# EAGLE design lightmeter (EAGLE 7.6.0)
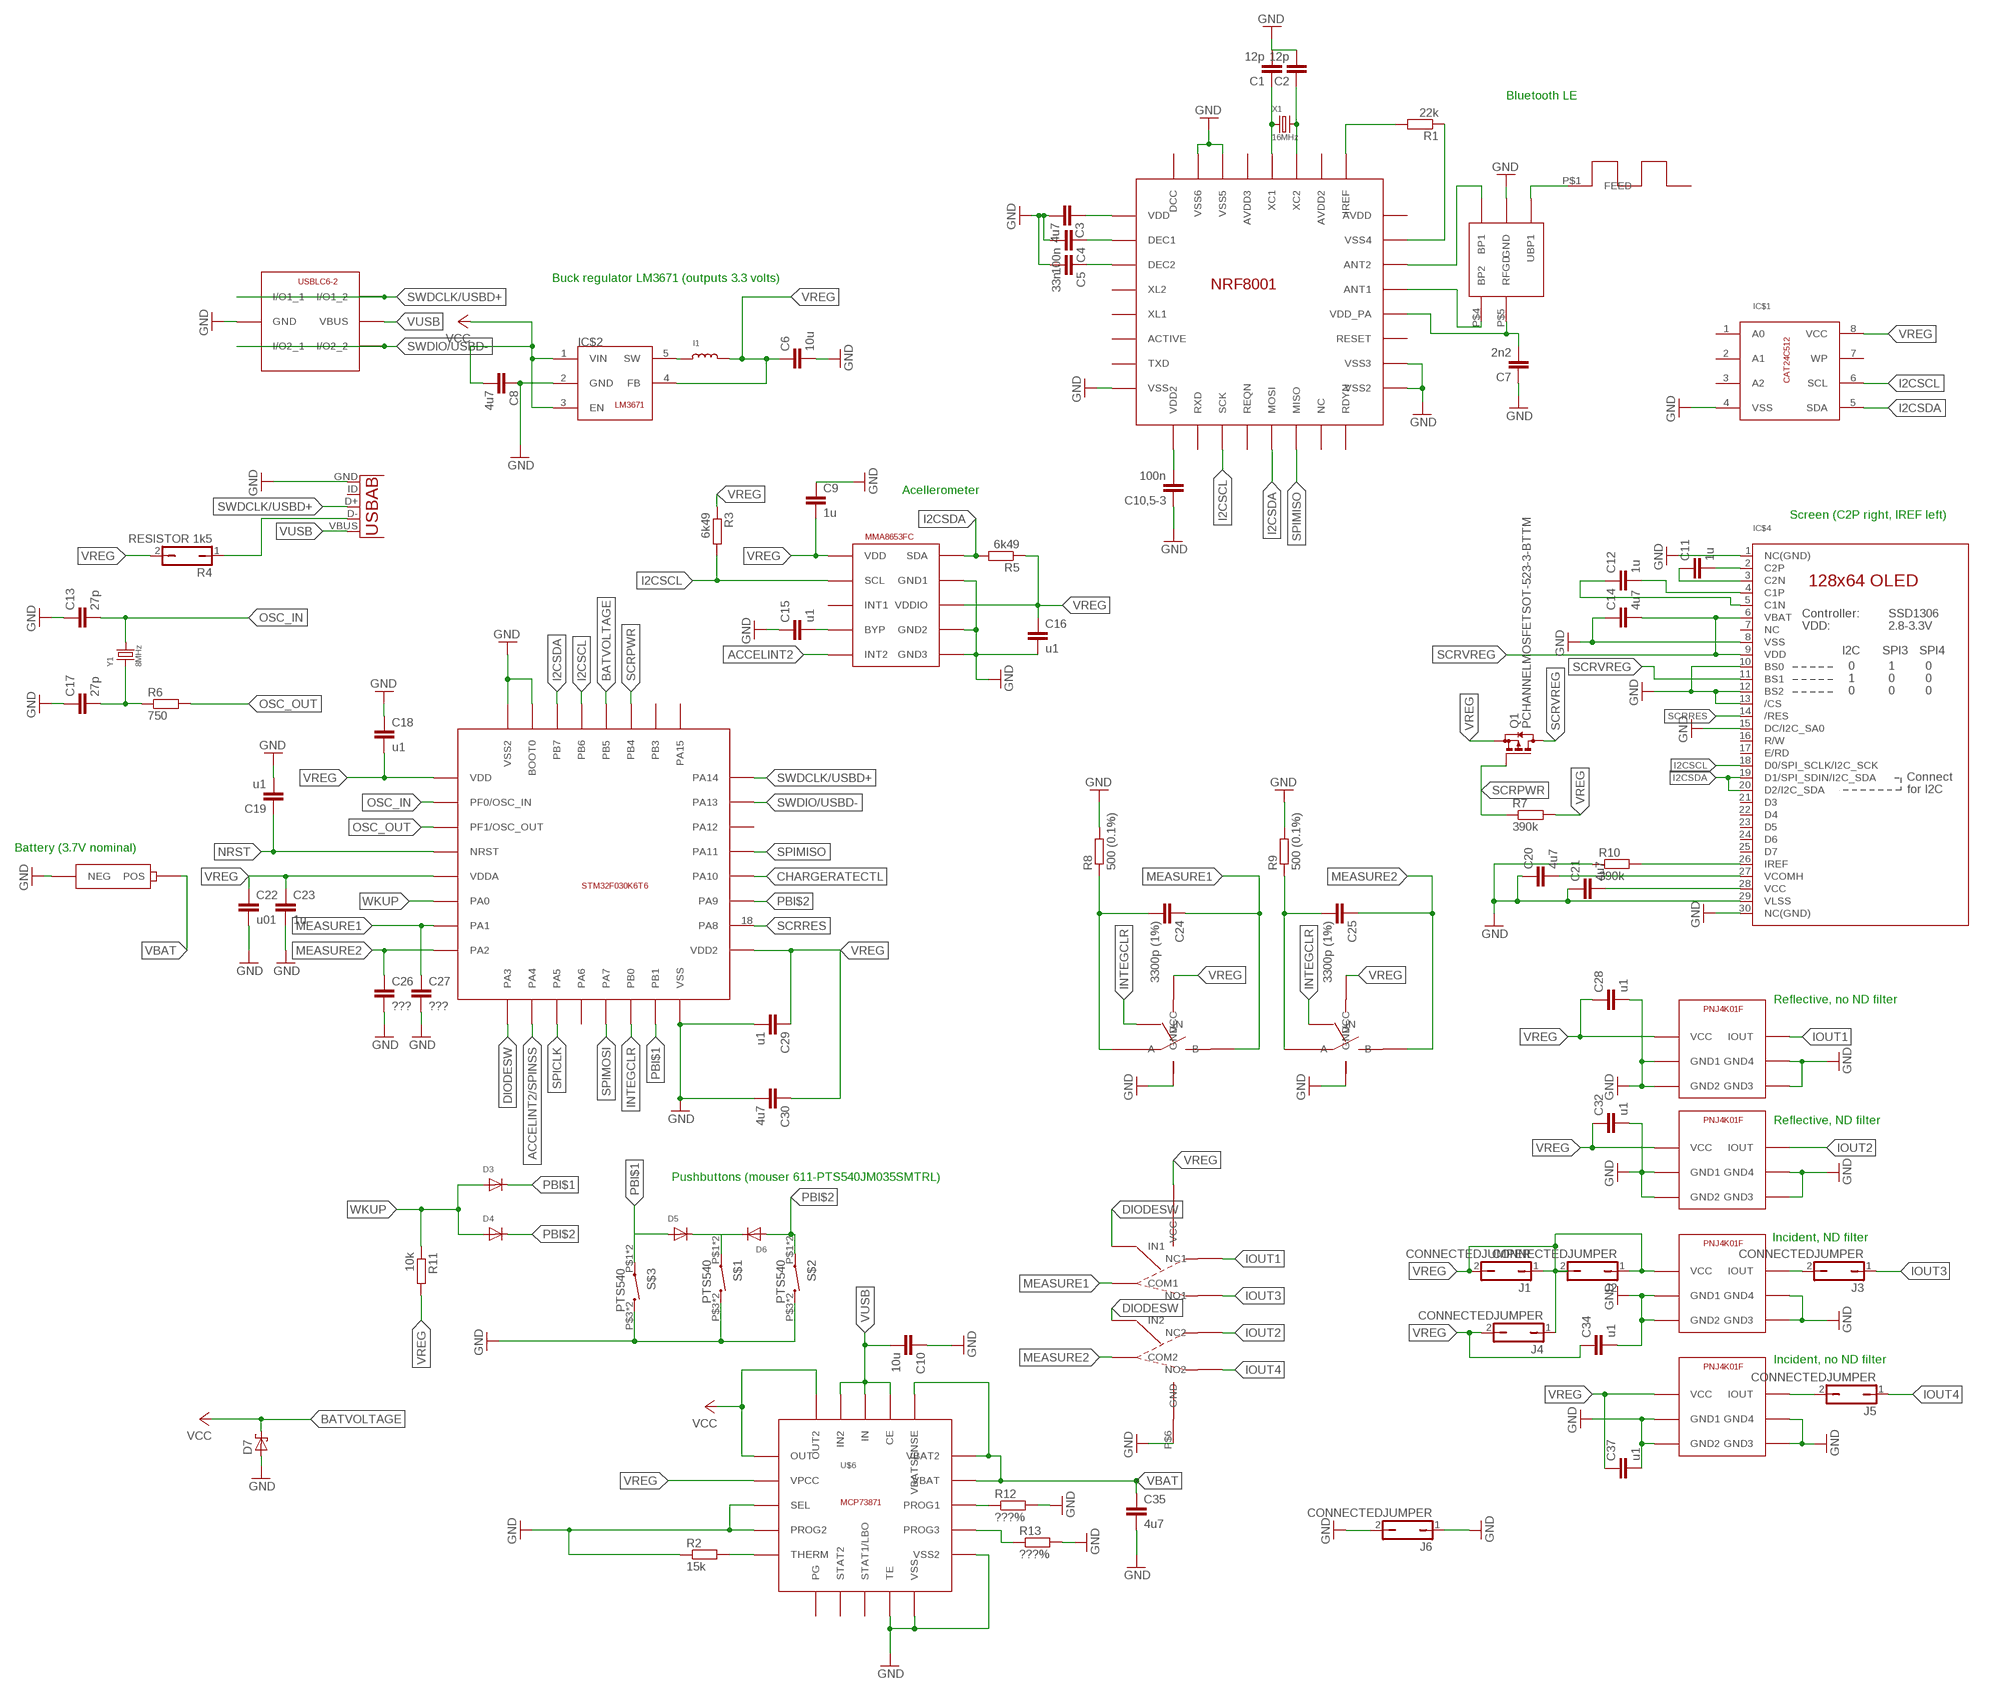
[diagram p0: schematic, sheet 1]

## Parts
C1  12p  C-EUC0402  [C0402]
C2  12p  C-EUC0402  [C0402]
C3  4u7  C-EUC0402  [C0402]
C4  100n  C-EUC0402  [C0402]
C5  33n  C-EUC0402  [C0402]
C6  10u  C-EUC0603  [C0603]
C7  2n2  C-EUC0402  [C0402]
C8  4u7  C-EUC0402  [C0402]
C9  1u  C-EUC0603  [C0603]
C10  10u  C-EUC0402  [C0402]
C10,5-3  100n  C-EUC0402  [C0402]
C11  1u  C-EUC0402  [C0402]
C12  1u  C-EUC0402  [C0402]
C13  27p  CGAP0402  [GAP0402]
C14  4u7  C-EUC0402  [C0402]
C15  u1  C-EUC0402  [C0402]
C16  u1  C-EUC0402  [C0402]
C17  27p  C-EUC0402  [C0402]
C18  u1  C-EUC0402  [C0402]
C19  u1  C-EUC0402  [C0402]
C20  4u7  C-EUC0402  [C0402]
C21  4u7  C-EUC0402  [C0402]
C22  u01  CGAP0402  [GAP0402]
C23  1u  C  [GAP0603]
C24  3300p (1%)  C-EUC0603  [C0603]
C25  3300p (1%)  C-EUC0603  [C0603]
C26  ???  CGAP0402  [GAP0402]
C27  ???  CGAP0402  [GAP0402]
C28  u1  C-EUC0402  [C0402]
C29  u1  C-EUC0402  [C0402]
C30  4u7  C-EUC0402  [C0402]
C32  u1  C-EUC0402  [C0402]
C34  u1  C-EUC0402  [C0402]
C35  4u7  C-EUC0402  [C0402]
C37  u1  C-EUC0402  [C0402]
D3  DIODESOD-323F  [SOD-323F]
D4  DIODESOD-323F  [SOD-323F]
D5  DIODESOD-323F  [SOD-323F]
D6  DIODESOD-323F  [SOD-323F]
D7  SCHOTTKY-DIODESOD-929  [SOD-923]
I1  CDRH2D14  [CDRH2D14]
IC$1  CAT24C512  [TSSOP8]
IC$2  LM3671  [SOT23-5]
IC$3  MMA8653  [DFN-10]
IC$4  DISP_OLED_UG-2864HSWEG010.96"  [UG-2864HSWEG01_0.96IN_WRAPAROUND]
IC$5  STM32F030K6T6  [QFP-32]
IC$6  SN74LVC1G66  [SOT-553-5]
IC$7  SN74LVC1G66  [SOT-553-5]
IC$8  PNJ4K01F  [PNJ4K01F]
IC$9  PNJ4K01F  [PNJ4K01F]
IC$11  PNJ4K01F  [PNJ4K01F]
IC$12  NLAS5223B  [WQFN10]
IC$13  PNJ4K01F  [PNJ4K01F]
J1  CONNECTEDJUMPER  [JUMPER_R0402]
J2  CONNECTEDJUMPER  [JUMPER_R0402]
J3  CONNECTEDJUMPER  [JUMPER_R0402]
J4  CONNECTEDJUMPER  [JUMPER_R0402]
J5  CONNECTEDJUMPER  [JUMPER_R0402]
J6  CONNECTEDJUMPER  [JUMPER_R0402]
Q1  PCHANNELMOSFETSOT-523-3-BTTM  [SOT-523-3-BTTM]
R1  22k  R-EU_R0402  [R0402]
R2  15k  R-EU_R0402  [R0402]
R3  6k49  R-EU_R0402  [R0402]
R4  RESISTOR 1k5  CONNECTEDJUMPER  [JUMPER_R0402]
R5  6k49  R-EU_R0402  [R0402]
R6  750  R-EU_R0402  [R0402]
R7  390k  R-EU_R0402  [R0402]
R8  500 (0.1%)  R-EU_R0402  [R0402]
R9  500 (0.1%)  R-EU_R0402  [R0402]
R10  390k  R-EU_R0402  [R0402]
R11  10k  R-EU_R0402  [R0402]
R12  ???%  R-EU_R0402  [R0402]
R13  ???%  R-EU_R0402  [R0402]
S$1  PTS540  [PTS540BTM]
S$2  PTS540  [PTS540BTM]
S$3  PTS540  [PTS540BTM]
U1  USB-ABUSB-AB-MICRO-MIDMOUNT  [USB-AB-MICRO-MIDMOUNT]
U$1  2450AT18A100  [2450AT18A100]
U$2  2450BM14A00022450BM14A0002  [2450BM14A0002]
U$3  NRF8001  [NRF8001]
U$4  USBLC6-2  [SOT666]
U$5  LIBAT  [78171-0002]
U$6  MCP73871  [QFN20]
X1  16MHz  CRYSTALCRYSTAL-2X1.6  [CRYSTAL-2X1.6]
Y1  8MHz  CRYSTAL  [CRYSTAL3.2X5MM]

## Nets
ACCELINT2: IC$3.P$5(INT2)
ACCELINT2/SPINSS: IC$5.10(PA4)
ANT1CON: U$2.P$4(BP2) U$3.P$21(ANT1)
ANT2CON: U$2.P$3(BP1) U$3.P$22(ANT2)
ANTTRACE: U$1.P$1(FEED) U$2.P$1(UBP1)
BATVOLTAGE: D7.P$2(C) IC$5.28(PB5) ; supply symbol labelled VCC
CHARGERATECTL: IC$5.20(PA10)
DIODESW: IC$5.9(PA3) IC$12.P$4(IN1) IC$12.P$8(IN2)
GND: C1.2 C2.2 C3.2 C4.2 C5.2 C6.2 C7.1 C8.1 C9.1 C10,5-3.1 C10.1 C13.1 C14.1 C15.1 C16.2 C17.1 C18.1 C19.2 C20.1 C21.1 C22.2 C23.2 C26.2 C27.2 C28.2 C29.2 C30.2 C32.2 C34.2 C35.2 C37.2 D7.P$1(A) IC$1.4(VSS) IC$2.2(GND) IC$3.P$6(GND3) IC$3.P$7(GND2) IC$3.P$9(GND1) IC$4.1(NC(GND)) IC$4.8(VSS) IC$4.10(BS0) IC$4.12(BS2) IC$4.13(/CS) IC$4.15(DC/I2C_SA0) IC$4.29(VLSS) IC$4.30(NC(GND)) IC$5.16(VSS) IC$5.31(BOOT0) IC$5.32(VSS2) IC$6.P$3(GND) IC$7.P$3(GND) IC$8.P$2(GND1) IC$8.P$3(GND2) IC$8.P$4(GND3) IC$8.P$5(GND4) IC$9.P$2(GND1) IC$9.P$3(GND2) IC$9.P$4(GND3) IC$9.P$5(GND4) IC$11.P$2(GND1) IC$11.P$3(GND2) IC$11.P$4(GND3) IC$11.P$5(GND4) IC$12.P$6(GND) IC$13.P$2(GND1) IC$13.P$3(GND2) IC$13.P$4(GND3) IC$13.P$5(GND4) J6.1 J6.2 R2.1 R8.2 R9.2 R10.1 R12.2 R13.2 S$1.P$3 S$1.P$4 S$2.P$3 S$2.P$4 S$3.P$3 S$3.P$4 U1.GND U$2.P$2(GND) U$3.P$8(VSS) U$3.P$17(VSS2) U$3.P$18(VSS3) U$3.P$30(VSS5) U$3.P$31(VSS6) U$3.P$33(VSS) U$4.P$2(GND) U$5.P$1(NEG) U$6.P$3(SEL) U$6.P$4(PROG2) U$6.P$9(TE) U$6.P$10(VSS) U$6.P$11(VSS2) U$6.P$21(VSS2)
I2CSCL: IC$1.6(SCL) IC$3.P$2(SCL) IC$4.18(D0/SPI_SCLK/I2C_SCK) IC$5.29(PB6) R3.2 U$3.P$11(SCK)
I2CSDA: IC$1.5(SDA) IC$3.P$10(SDA) IC$4.19(D1/SPI_SDIN/I2C_SDA) IC$4.20(D2/I2C_SDA) IC$5.30(PB7) R5.2 U$3.P$13(MOSI)
INTEGCLR: IC$5.14(PB0) IC$6.P$4(IN) IC$7.P$4(IN)
IOUT1: IC$8.P$6(IOUT) IC$12.P$5(NC1)
IOUT2: IC$9.P$6(IOUT) IC$12.P$7(NC2)
IOUT3: IC$12.P$2(NO1) J3.1
IOUT4: IC$12.P$10(NO2) J5.1
MEASURE1: C24.1 C27.1 IC$5.7(PA1) IC$6.P$2(B) IC$12.P$3(COM1)
MEASURE2: C25.1 C26.1 IC$5.8(PA2) IC$7.P$2(B) IC$12.P$9(COM2)
N$1: IC$11.P$6(IOUT) J3.2
N$2: IC$13.P$6(IOUT) J5.2
N$3: C24.2 IC$6.P$1(A) R8.1
N$4: R2.2 U$6.P$5(THERM)
N$6: C25.2 IC$7.P$1(A) R9.1
N$7: C15.2 IC$3.P$4(BYP)
N$9: C17.2 R6.1 Y1.P$1
N$10: I1.P$1 IC$2.5(SW)
N$12: C20.2 IC$4.27(VCOMH)
N$13: D5.C D6.C S$1.P$1 S$1.P$2
N$15: C11.2 IC$4.2(C2P)
N$16: C11.1 IC$4.3(C2N)
N$17: C7.2 U$2.P$5(RFGD) U$3.P$20(VDD_PA)
N$18: R1.2 U$3.P$25(IREF)
N$19: IC$4.26(IREF) R10.2
N$20: R1.1 U$3.P$23(VSS4)
N$21: C5.1 U$3.P$3(DEC2)
N$22: C3.1 U$3.P$1(VDD)
N$23: C10,5-3.2 U$3.P$9(VDD2)
N$24: C12.1 IC$4.5(C1N)
N$25: C4.1 U$3.P$2(DEC1)
N$26: C1.1 U$3.P$28(XC1) X1.P$1
N$27: C12.2 IC$4.4(C1P)
N$28: C2.1 U$3.P$27(XC2) X1.P$3
N$30: C21.2 IC$4.28(VCC)
N$32: R12.1 U$6.P$13(PROG1)
N$33: R13.1 U$6.P$12(PROG3)
NRST: C19.1 IC$5.4(NRST)
OSC_IN: C13.2 IC$5.2(PF0/OSC_IN) Y1.P$2
OSC_OUT: IC$5.3(PF1/OSC_OUT) R6.2
PBI$1: D3.C D5.A IC$5.15(PB1) S$3.P$1 S$3.P$2
PBI$2: D4.C D6.A IC$5.19(PA9) S$2.P$1 S$2.P$2
SCRPWR: IC$5.27(PB4) Q1.P$3(G) R7.1
SCRRES: IC$4.14(/RES) IC$5.18(PA8)
SCRVREG: C14.2 IC$4.6(VBAT) IC$4.9(VDD) IC$4.11(BS1) Q1.P$1(D)
SPICLK: IC$5.11(PA5)
SPIMISO: IC$5.21(PA11) U$3.P$14(MISO)
SPIMOSI: IC$5.13(PA7)
SWDCLK/USBD+: IC$5.24(PA14) U1.D+ U$4.P$1(I/O1_1) U$4.P$6(I/O1_2)
SWDIO/USBD-: IC$5.23(PA13) U$4.P$3(I/O2_1) U$4.P$4(I/O2_2)
USBD-: R4.1 U1.D-
VBAT: C35.1 U$5.P$2(POS) U$6.P$14(VBAT) U$6.P$15(VBAT2) U$6.P$16(VBATSENSE)
VCC: C8.2 IC$2.1(VIN) IC$2.3(EN) U$6.P$1(OUT) U$6.P$20(OUT2)
VREG: C6.1 C9.2 C16.1 C18.2 C22.1 C23.1 C28.1 C29.1 C30.1 C32.1 C34.1 C37.1 I1.P$2 IC$1.8(VCC) IC$2.4(FB) IC$3.P$1(VDD) IC$3.P$8(VDDIO) IC$5.1(VDD) IC$5.5(VDDA) IC$5.17(VDD2) IC$6.P$5(VCC) IC$7.P$5(VCC) IC$8.P$1(VCC) IC$9.P$1(VCC) IC$11.P$1(VCC) IC$12.P$1(VCC) IC$13.P$1(VCC) J1.1 J1.2 J2.1 J2.2 J4.1 J4.2 Q1.P$2(S) R3.1 R4.2 R5.1 R7.2 R11.2 U$6.P$2(VPCC)
VUSB: C10.2 U1.VBUS U$4.P$5(VBUS) U$6.P$17(CE) U$6.P$18(IN) U$6.P$19(IN2)
WKUP: D3.A D4.A IC$5.6(PA0) R11.1
Unconnected: IC$1.1(A0) IC$1.2(A1) IC$1.3(A2) IC$1.7(WP) IC$3.P$3(INT1) IC$4.7(NC) IC$4.16(R/W) IC$4.17(E/RD) IC$4.21(D3) IC$4.22(D4) IC$4.23(D5) IC$4.24(D6) IC$4.25(D7) IC$5.12(PA6) IC$5.22(PA12) IC$5.25(PA15) IC$5.26(PB3) U1.ID(USBID) U$3.P$4(XL2) U$3.P$5(XL1) U$3.P$6(ACTIVE) U$3.P$7(TXD) U$3.P$10(RXD) U$3.P$12(REQN) U$3.P$15(NC) U$3.P$16(RDYN) U$3.P$19(RESET) U$3.P$24(AVDD) U$3.P$26(AVDD2) U$3.P$29(AVDD3) U$3.P$32(DCC) U$6.P$6(PG) U$6.P$7(STAT2) U$6.P$8(STAT1/LBO)

## Notes on the sheet
- Bluetooth LE
- Buck regulator LM3671 (outputs 3.3 volts)
- Acellerometer
- Screen (C2P right, IREF left)
- Battery (3.7V nominal)
- Reflective, no ND filter
- Reflective, ND filter
- Pushbuttons (mouser 611-PTS540JM035SMTRL)
- Incident, ND filter
- Incident, no ND filter

## Library data of the parts
C1-C10 C10,5-3 C11 C12 C14-C21 C24 C25 C28-C30 C32 C34 C35 C37 = rcl:C-EU: CAPACITOR, European symbol
C13 C22 C23 C26 C27 = lightmeter:C: CAPACITOR naming: grid - package width
D3-D6 = adafruit:DIODE: Diode SMADIODE - SMA Surface Mount Package 20V 1A Schottky Diode Digikey: 641-1014-6-ND DO-1N4148 - Through Hole Small Current Diode SOD-123 20V 1 A (.5mV Vf) Schottky Diode - Digikey: MBRX120TPMSCT-ND SOD-323 10V 570mA (.38mV Vf, 3ns) Schottky Diode - Digikey: ZLLS410CT-ND SOD-523 30V 30mA Schottky Diode (RB751S-40TE61) - Digikey: RB751S-40TE61CT-ND SOT23-R/W - SOT23 Package (R = Solder Paste/Reflow Ovens, W = Hand-Soldering) BAT54Film 40V 300mA - Digikey: 497-7162-1-ND
D7 = lightmeter:SCHOTTKY-DIODE: Schottky Diode
I1 = lightmeter:CDRH2D14
IC$1 = lightmeter:CAT24C512
IC$2 = lightmeter:LM3671
IC$3 = lightmeter:MMA8653
IC$4 = microbuilder:DISP_OLED_UG-2864HSWEG01: UG-2864HSWEG01 OLED display Both 1.3" and 0.96" models share the same FPC tab footprint, only the screen dimensions vary.
IC$5 = lightmeter:STM32F030K6T6
IC$6 IC$7 = lightmeter:SN74LVC1G66
IC$8 IC$9 IC$11 IC$13 = lightmeter:PNJ4K01F
IC$12 = lightmeter:NLAS5223B
J1-J6 R4 = lightmeter:CONNECTEDJUMPER
Q1 = lightmeter:PCHANNELMOSFET
R1-R3 R5-R13 = resistor:R-EU_: RESISTOR, European symbol
S$1-S$3 = lightmeter:PTS540
U1 = lightmeter:USB-AB: This is a USB AB connector that is compatible with USB OTG. i.e. this connector can serve as a host or device
U$1 = lightmeter:2450AT18A100
U$2 = lightmeter:2450BM14A0002
U$3 = lightmeter:NRF8001
U$4 = lightmeter:USBLC6-2
U$5 = lightmeter:LIBAT
U$6 = lightmeter:MCP73871
X1 Y1 = lightmeter:CRYSTAL

## Board
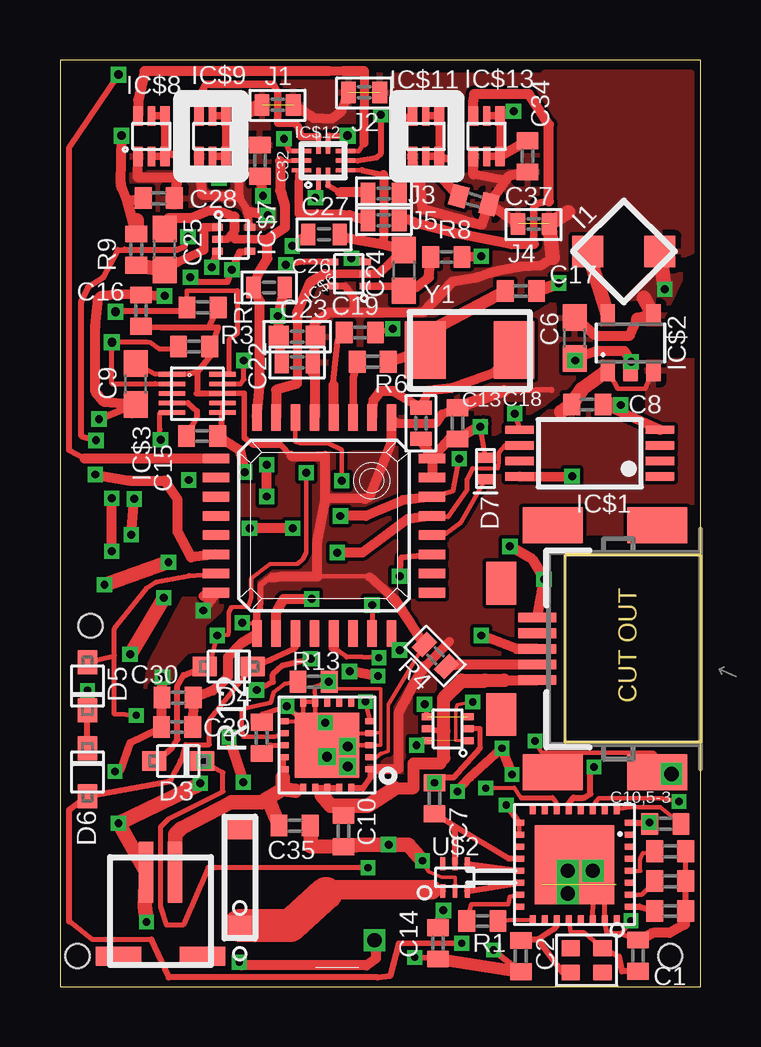
[diagram p1: board, top side]
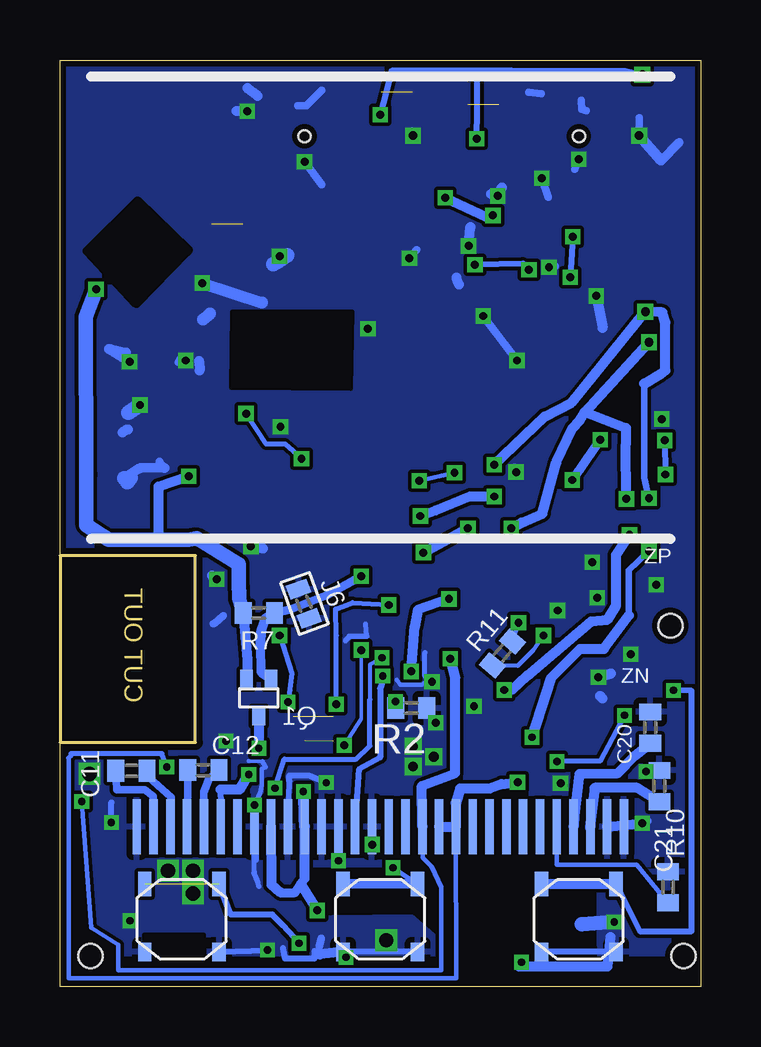
[diagram p2: board, bottom side, seen from below]

Size 26.7 x 38.61 mm. Coordinates in mm from the lower left corner, seen from the top.
Outline: 0,0 26.7,0 26.7,38.61 0,38.61 0,0
Copper layers (1*16): Top 0.035mm / dielectric 1.5mm / Bottom 0.035mm
Design rules "SeeedStudio_2layer_DRU_no_angle_20140221": minimum track width 6mil, minimum drill 12mil, track to track 6mil, track to pad 6mil, pad to pad 6mil, via to via 6mil, smd to smd 0mil, copper to edge 10mil, drill to drill 10mil, minimum pad ring 10mil, minimum via ring 6mil, stop-mask expansion 2mil, vias tented up to drill 100mil, thermal gap 10mil
Holes 1 mm at 25.43,1.27 0.72,1.27 1.27,15.04
Holes 0.5 mm at 5.08,35.43 16.51,35.43
tRestrict: area 3,34.9 to 4.6,36; area 5.6,34.9 to 7.1,36; area 14.5,34.9 to 16,36; area 17,34.9 to 18.6,36; area 21.4,28.7 to 25.2,32.6; area 22.4,26 to 25.2,27.6; area 9.6,32.6 to 12.3,35.6; area 7.5,15.2 to 14.2,15.9; area 14.6,22.7 to 16.8,24.1; area 7.6,22.5 to 13.7,23.1; area 20.6,27.9 to 22.2,29.4; area 23.2,27.8 to 24.2,28.5
bRestrict: area 6.7,1.5 to 16.1,4.9; area 4.4,0.5 to 9.1,5.5; area 20.7,0.1 to 23.2,2.2; area 21.4,28.5 to 25.6,32.7; area 14.5,24.9 to 19.6,28.1; 3 lines

### Footprints (pad centres in the part's own frame; a part is rotated, then mirrored left to right if it is on the bottom)
C0402 = smd 0.7 x 0.9: 1 -0.65,0; 2 0.65,0
C0603 = smd 1.1 x 1: 1 -0.85,0; 2 0.85,0
GAP0402 = smd 0.584 x 0.9: 1 -0.65,0; 2 0.65,0
GAP0603 = smd 0.819 x 0.9: 1 -0.767,0; 2 0.767,0
SOD-323F = smd 1 x 0.8: A -1,0; C 1,0
SOD-923 = smd 0.425 x 0.6: P$1 -0.45,0; P$2 0.45,0
CDRH2D14 = smd 1.3 x 1.3 rotated 45: P$1 -1.061,1.061; P$2 1.061,-1.061
TSSOP8 = smd 1.2 x 0.35: 1 -2.925,0.975; 2 -2.925,0.325; 3 -2.925,-0.325; 4 -2.925,-0.975; 5 2.925,-0.975; 6 2.925,-0.325; 7 2.925,0.325; 8 2.925,0.975
SOT23-5 = smd 0.6 x 0.9: 1 -0.95,-1.15; 2 0,-1.15; 3 0.95,-1.15; 4 0.95,1.15; 5 -0.95,1.15
DFN-10 = smd 0.191 x 1.099: P$1 -0.8,-1.048; P$2 -0.4,-1.048; P$3 0,-1.048; P$4 0.4,-1.048; P$5 0.8,-1.048; P$6 0.8,1.048; P$7 0.4,1.048; P$8 0,1.048; P$9 -0.4,1.048; P$10 -0.8,1.048
UG-2864HSWEG01_0.96IN_WRAPAROUND = smd 0.35 x 2.286 bottom: 1 -10.15,-1.2; 2 -9.45,-1.2; 3 -8.75,-1.2; 4 -8.05,-1.2; 5 -7.35,-1.2; 6 -6.65,-1.2; 7 -5.95,-1.2; 8 -5.25,-1.2; 9 -4.55,-1.2; 10 -3.85,-1.2; 11 -3.15,-1.2; 12 -2.45,-1.2; 13 -1.75,-1.2; 14 -1.05,-1.2; 15 -0.35,-1.2; 16 0.35,-1.2; 17 1.05,-1.2; 18 1.75,-1.2; 19 2.45,-1.2; 20 3.15,-1.2; 21 3.85,-1.2; 22 4.55,-1.2; 23 5.25,-1.2; 24 5.95,-1.2; 25 6.65,-1.2; 26 7.35,-1.2; 27 8.05,-1.2; 28 8.75,-1.2; 29 9.45,-1.2; 30 10.15,-1.2
QFP-32 = smd 0.4 x 1.1: 1 -2.4,-4.1; 2 -1.6,-4.1; 3 -0.8,-4.1; 4 0,-4.1; 5 0.8,-4.1; 6 1.6,-4.1; 7 2.4,-4.1; 8 3.2,-4.1; 17 3.2,4.9; 18 2.4,4.9; 19 1.6,4.9; 20 0.8,4.9; 21 0,4.9; 22 -0.8,4.9; 23 -1.6,4.9; 24 -2.4,4.9 | smd 1.1 x 0.4: 9 4.9,-2.4; 10 4.9,-1.6; 11 4.9,-0.8; 12 4.9,0; 13 4.9,0.8; 14 4.9,1.6; 15 4.9,2.4; 16 4.9,3.2; 25 -4.1,3.2; 26 -4.1,2.4; 27 -4.1,1.6; 28 -4.1,0.8; 29 -4.1,0; 30 -4.1,-0.8; 31 -4.1,-1.6; 32 -4.1,-2.4
SOT-553-5 = smd 0.45 x 0.279: P$1 -0.675,0.5; P$2 -0.675,0; P$3 -0.675,-0.5; P$4 0.675,-0.5; P$5 0.675,0.5
PNJ4K01F = smd 0.813 x 0.401: P$1 -0.843,0.56; P$3 -0.843,-0.56; P$4 0.843,-0.56; P$6 0.843,0.56 | smd 0.813 x 0.3: P$2 -0.843,0; P$5 0.843,0
WQFN10 = smd 0.917 x 0.178: P$1 -0.747,0.199 | smd 0.815 x 0.178: P$2 -0.696,-0.199; P$6 0.696,-0.199; P$7 0.696,0.199 | smd 0.178 x 0.815: P$3 -0.399,-0.914; P$4 0,-0.914; P$5 0.399,-0.914 | smd 0.178 x 0.805: P$8 0.399,0.914; P$9 0,0.914; P$10 -0.399,0.914
JUMPER_R0402 = smd 0.61 x 0.9: 1 -0.65,0; 2 0.65,0
SOT-523-3-BTTM = smd 0.533 x 0.762 bottom: P$1 0,0.775; P$2 -0.511,-0.775; P$3 0.511,-0.775
R0402 = smd 0.7 x 0.9: 1 -0.65,0; 2 0.65,0
PTS540BTM = smd 0.559 x 1.016 bottom: P$1 -1.55,1.477; P$2 1.55,1.477 | smd 0.559 x 0.762 bottom: P$3 -1.55,-1.35; P$4 1.55,-1.35
USB-AB-MICRO-MIDMOUNT = smd 1.579 x 0.4: D+ 3.378,0; D- 3.378,0.65; GND 3.378,-1.3; ID 3.378,-0.65; VBUS 3.378,1.3 | smd 2.5 x 1.5: P$1 -1.625,-5.15; P$2 -1.625,5.15; P$6 2.725,5.15; P$7 2.725,-5.15 | smd 1.246 x 1.778: P$3 4.883,2.733; P$4 4.883,-2.733
2450AT18A100 = smd 0.8 x 1.27: P$1 2,0; P$2 -2,0
2450BM14A0002 = smd 0.203 x 0.559: P$1 0.508,0.572; P$2 0,0.572; P$3 -0.508,0.572; P$4 -0.508,-0.572; P$5 0,-0.572; P$6 0.508,-0.572
NRF8001 = smd 0.4 x 0.25: P$1 -2.3,1.75; P$2 -2.3,1.25; P$3 -2.3,0.25; P$4 -2.3,-0.25; P$5 -2.3,-0.75; P$6 -2.3,0.75; P$7 -2.3,-1.25; P$8 -2.3,-1.75; P$17 2.3,-1.75; P$18 2.3,-1.25; P$19 2.3,-0.75; P$20 2.3,-0.25; P$21 2.3,0.25; P$22 2.3,0.75; P$23 2.3,1.25; P$24 2.3,1.75 | smd 0.25 x 0.4: P$9 -1.75,-2.3; P$10 -1.25,-2.3; P$11 -0.75,-2.3; P$12 -0.25,-2.3; P$13 0.25,-2.3; P$14 0.75,-2.3; P$15 1.25,-2.3; P$16 1.75,-2.3; P$25 1.75,2.3; P$26 1.25,2.3; P$27 0.75,2.3; P$28 0.25,2.3; P$29 -0.25,2.3; P$30 -0.75,2.3; P$31 -1.25,2.3; P$32 -1.75,2.3 | smd 3.3 x 3.3: P$33 0,0
SOT666 = smd 0.3 x 0.508: P$1 -0.5,-0.83; P$2 0,-0.83; P$3 0.5,-0.83; P$4 0.5,0.83; P$5 0,0.83; P$6 -0.5,0.83
78171-0002 = smd 0.6 x 2.54: P$1 -0.6,1.61; P$2 0.6,1.61 | smd 1.905 x 0.8: P$300 -1.75,-1.887; P$400 1.75,-1.887
QFN20 = smd 0.4 x 0.25: P$1 -1.8,1; P$2 -1.8,0.5; P$3 -1.8,0; P$4 -1.8,-0.5; P$5 -1.8,-1; P$11 1.8,-1; P$12 1.8,-0.5; P$13 1.8,0; P$14 1.8,0.5; P$15 1.8,1 | smd 0.25 x 0.4: P$6 -1,-1.8; P$7 -0.5,-1.8; P$8 0,-1.8; P$9 0.5,-1.8; P$10 1,-1.8; P$16 1,1.8; P$17 0.5,1.8; P$18 0,1.8; P$19 -0.5,1.8; P$20 -1,1.8 | smd 2.7 x 2.7: P$21 0,0
CRYSTAL-2X1.6 = smd 0.762 x 0.66: P$1 -0.66,-0.508; P$2 0.66,-0.508; P$3 0.66,0.508; P$4 -0.66,0.508
CRYSTAL3.2X5MM = smd 1.7 x 2.4: P$1 -1.85,0; P$2 1.85,0

### Placement (x,y rotation side)
C1  24.08,1.3 90 top
C2  19.2,1.27 270 top
C3  25.43,3.15 0 top
C4  25.43,4.39 0 top
C5  25.43,5.64 0 top
C6  21.44,27.03 270 top
C7  15.61,7.85 270 top
C8  21.97,24.26 180 top
C9  3.15,25.11 90 top
C10  11.81,6.48 90 top
C10,5-3  25.22,6.78 0 top
C11  23.72,8.99 180 bottom
C12  20.73,9.02 180 bottom
C13  15.04,23.47 90 top
C14  15.75,1.8 90 top
C15  5.92,22.94 180 top
C16  3.38,28.17 90 top
C17  19.2,28.98 180 top
C18  16.56,23.47 90 top
C19  12.5,27.25 0 top
C20  2.11,10.79 270 bottom
C21  1.73,8.36 270 bottom
C22  9.88,26.01 180 top
C23  9.88,27.08 180 top
C24  14.33,29.85 270 top
C25  4.36,30.72 270 top
C26  8.71,29.13 0 top
C27  11,31.34 180 top
C28  4.11,32.85 180 top
C29  4.88,10.82 180 top
C30  4.9,12.04 180 top
C32  8.33,34.42 270 top
C34  19.48,34.59 90 top
C35  9.78,6.71 0 top
C37  17.25,32.77 165 top
D3  4.93,9.4 0 top
D4  7.04,13.33 0 top
D5  1.14,12.52 270 top
D6  1.14,8.94 90 top
D7  17.73,21.59 270 top
I1  23.5,30.63 45 top
IC$1  22.07,22.23 180 top
IC$2  23.77,26.82 0 top
IC$3  5.71,24.71 270 top
IC$4  13.35,5.46 180 top
IC$5  11.4,19.61 180 top
IC$6  12.04,29.69 180 top
IC$7  7.24,31.14 0 top
IC$8  3.81,35.43 90 top
IC$9  6.35,35.43 90 top
IC$11  15.24,35.43 90 top
IC$12  10.97,34.42 90 top
IC$13  17.78,35.43 90 top
J1  9.07,36.74 180 top
J2  12.67,37.26 180 top
J3  13.49,33.05 0 top
J4  19.74,31.78 180 top
J5  13.49,31.93 0 top
J6  16.54,15.95 290 bottom
Q1  18.41,12.04 180 top
R1  17.6,2.73 0 top
R2  12.07,11.61 180 bottom
R3  5.59,26.67 180 top
R4  15.65,13.79 135 top
R5  5.94,28.3 180 top
R6  13.03,26.04 180 top
R7  18.41,15.56 180 bottom
R8  16.1,30.4 0 top
R9  3.18,30.71 90 top
R10  1.37,4.14 270 bottom
R11  8.27,13.88 50 bottom
R12  8.41,10.36 90 top
R13  10.57,12.7 0 top
S$1  5.08,2.79 0 top
S$2  21.62,2.79 0 top
S$3  13.35,2.79 0 top
U1  23.27,14.07 180 top
U$1  7.49,4.55 270 top
U$2  16.46,4.55 180 top
U$3  21.44,5.08 180 top
U$4  16.15,10.74 90 top
U$5  4.19,3.15 0 top
U$6  11.13,10.06 180 top
X1  21.95,1.09 180 top
Y1  17.07,26.52 0 top

### Tracks (layer width: path | path; a pad name or v marks a point on that pad's centre or on a via)
ACCELINT2  (via drill 0.33)
  Top 0.203: v4.19,22.78 4.17,23.22 4.17,23.9 IC$3.P$5
  Bottom 0.356: v5.36,21.11 v4.19,22.78
ANT1CON
  Top 0.254: U$2.P$4 U$3.P$21
ANT2CON
  Top 0.254: U$2.P$3 U$3.P$22
ANTTRACE
  Top 0.254: U$2.P$1 15.49,4.04 | 11.07,3.89 11.34,4.04
  Top 0.817: 15.49,4.04 11.34,4.04
  Top 1.376: U$1.P$1 9.61,2.55 11.07,3.89
BATVOLTAGE
  Top 0.203: IC$5.28 16.1,18.9 16.71,19.36 D7.P$2
DIODESW  (via drill 0.33, 0.36)
  Top 0.178: 12.41,34.41 IC$12.P$4 | IC$12.P$8 9.55,34.82
  Top 0.229: 13.18,34.54 12.41,34.41 | 9.55,34.82 v9.33,35.33
  Top 0.254: 13.18,34.54 13.36,34.7 v13.36,36.32 | 1.02,22.01 0.38,22.35 0.38,34.95 v2.44,38
  Top 0.406: 1.02,22.01 IC$5.9
  Bottom 0.254: v2.44,38 3.15,38.15 7.85,38.15 8.3,38.15 11.2,38.17 | 11.2,38.17 12.88,38.15 v13.36,36.32 | 11.2,38.17 9.32,37.92 9.32,36.55 v9.33,35.33
GND  (via drill 0.3, 0.33, 0.36, 0.41, 0.6)
  Top 0.152: U$2.P$2 16.46,4.56 15.9,4.56 15.37,4.79 v15.1,5.25 | U$6.P$3 13.37,10.06 13.37,12.41 11.33,12.41 | 13.36,10.59 13.36,10.57 12.85,10.57 U$6.P$4
  Top 0.178: IC$12.P$6 11.2,35.46 | 20.18,6.55 U$3.P$33 | U$3.P$17 U$3.P$18 | 25.98,5.74 C5.2 | 25.5,8.84 24.71,9.75 20.07,9.75 19.79,10.21 v19.79,10.24 | IC$2.2 v23.8,26.04 | U$6.P$9 10.64,10.97 | U$6.P$21 U$6.P$3 | U$6.P$4 11.38,10.54 | 10.13,9.93 U$6.P$10 U$6.P$9 | U$6.P$11 v11.05,11 | R13.2 10.62,12.5 U$6.P$9
  Top 0.203: IC$3.P$9 7.53,25.11 7.66,25.3 v7.66,26.09 | IC$3.P$7 IC$3.P$6 | D7.P$1 v17.51,23.33 | 22.23,4.54 22.68,4.14 U$3.P$31 22.81,2.21 23.39,2.21 | 22.23,4.54 U$3.P$33 | U$3.P$30 22.23,4.54 | v4.52,17.68 4.47,17.68 | v23.79,2.74 23.39,2.21 | 23.39,2.21 C1.2 | 17.5,9.96 17.5,10.74 U$4.P$2 | C4.2 C5.2 | 9.86,11.3 v9.45,11.68 8.41,11.35 R12.2
  Top 0.254: C9.1 3,23.8 | C15.1 6.75,23.21 IC$3.P$6 6.75,23.67 | 11.2,35.46 v11.99,35.46 | C19.2 v13.87,27.41 | C7.1 v15.61,8.5 15.8,8.71 16.4,8.71 17.5,9.96 | v18.06,1.52 C2.2 | C14.1 v14.78,1.22 | U$3.P$17 v18.59,7.57 | C10,5-3.1 v24.56,6.83 U$3.P$8 | C3.2 C4.2 | 10.64,10.97 U$6.P$21 | 11.38,10.54 U$6.P$21 | v11.05,11 U$6.P$21 | 11.89,10.85 U$6.P$21
  Top 0.305: 2.59,35.43 v2.56,35.46 | C9.1 v1.63,23.65 | U1.GND 19.89,15.44 | IC$8.P$5 IC$8.P$4 IC$8.P$3 | IC$8.P$3 IC$8.P$2 | IC$8.P$3 4.32,34.85 v5.08,34.47 | IC$9.P$2 IC$9.P$3 | v6.63,33.68 6.35,33.86 IC$9.P$2 | IC$11.P$5 IC$11.P$4 IC$11.P$3 | IC$11.P$2 IC$11.P$3 | IC$11.P$3 v16.51,34.37 | IC$13.P$2 IC$13.P$3 IC$13.P$4 IC$13.P$5 | IC$7.P$3 v6.32,29.97 | IC$6.P$3 v12.14,30.35 | IC$9.P$5 IC$9.P$4 IC$9.P$3 IC$9.P$2 | 4.09,10.72 2.92,10.16 2.54,9.04 v2.29,8.97
  Top 0.356: 23.77,25.5 IC$2.2
  Top 0.406: IC$5.32 IC$5.31 | 5.98,16.28 IC$5.16 v5.97,15.67 | IC$5.32 16.28,22.87 C18.1 17.64,23.46 v17.51,23.33 | v4.36,28.78 C16.2 2.29,28.85 1.7,28.78 1.6,28.68 1.47,27.51 1.47,24.79 1.82,24.37 C9.1 | v4.27,12.89 C30.2 C29.2 | v2.56,35.46 2.54,33.45 2.59,33.25 2.79,32.74 | R9.2 2.79,32.74 | C15.1 7.49,22.35 v7.7,21.44 | 2.79,32.74 C28.2 | IC$11.P$3 15.8,33.83 C37.2 | C22.2 C23.2 v9.07,27.94 C26.2 | C34.2 IC$13.P$3 | IC$13.P$4 v18.9,36.47 | IC$5.32 C13.1 | R8.2 v17.55,30.43 | C27.2 v9.68,30.86 | C32.2 v8.46,32.94 | IC$1.4 C8.1 | 2.92,13.82 v2.92,13.84 | v18.75,18.34 19.68,17.81 v20.17,16.97 U1.GND | 26.04,3.07 26.04,2.59 25.4,2.24 24.71,2.24 24.32,2.02 | v7.47,1.02 7.57,0.89 12.78,0.89 13.16,1.17 13.16,1.91 v13.11,1.93 | 23.75,25.65 v23.8,26.04 23.52,26.49 22.38,26.49 C6.2
  Top 0.508: C17.1 v20.78,29.31 | C14.1 C2.2 | 24.13,1.93 24.32,2.02 C1.2 | C3.2 26.04,3.07
  Top 0.61: R9.2 3.2,31.93 | C8.1 v23.37,24.23 | 4.32,16.18 2.92,13.82 | v1.85,16.74 4.5,17.68 | v3.61,2.69 3.53,3.35 U$5.P$1 v2.44,6.81 5.87,8.46 | v15.1,5.25 14.5,5.92 12.52,5.92 C10.1 10.44,5.84 C35.2
  Bottom 0.152: 11.46,12.7 R13.2
  Bottom 0.165: 15.78,8.65 15.75,8.62 | 18.26,9.37 18.85,9.4
  Bottom 0.178: IC$4.8 18.59,7.59 | 18.59,7.59 18.36,8.08 18.29,8.38 18.29,9.07 18.14,9.14 | v18.59,7.57 18.59,7.59 | 7.57,0.84 v7.47,1.02 | 11.46,12.7 11.63,12.57 12.52,12.57 12.68,12.78
  Bottom 0.203: 11.49,12.93 11.49,13.92 | 18.41,4.17 18.44,4.32 18.62,4.77 18.6,4.77 IC$4.8 | v23.79,2.74 23.9,2.95 | v15.1,5.25 15.11,5.1 15.06,5.82 | 18.26,9.37 18.14,9.14 | 13.92,14.6 13.97,15.11 | 14.81,14.4 14.63,14.6
  Bottom 0.229: IC$4.10 17.14,8.56 | 13.92,14.6 14.63,14.6 14.66,14.6
  Bottom 0.254: v11.99,35.46 12.04,35.69 | S$3.P$3 S$3.P$4 v14.78,1.22 | S$1.P$3 S$1.P$4 | IC$4.10 17.22,6.91 | v13.87,27.41 14.05,27.51 | 18.24,18.24 18.24,18.26 | 15.67,8.53 15.47,8.66 | 15.78,8.65 v15.61,8.5 16.33,8.79 17.14,8.79 17.14,8.56 | S$2.P$3 v18.06,1.52 | v24.56,6.83 24.56,7.67 | 16.1,1.47 16.1,1.17 17.32,1.17 17.4,1.6 | IC$4.15 v13.69,5.92
  Bottom 0.305: v7.66,26.09 v9.07,27.94 | 15.8,37.34 16.43,36.7 16.79,36.7 | 4.98,36.93 4.95,36.55 4.78,36.5 | 18.57,5.3 IC$4.8 | v2.56,35.46 2.56,36.2 | 15.82,2.01 15.89,1.66 | v1.63,23.65 1.5,23.7 | 19.89,15.44 20.24,15.14 20.32,15.11 | v5.08,34.47 5.26,34.06 | v6.63,33.68 6.35,32.89 | 6.65,37.21 7.16,37.26 | v16.51,34.37 15.8,33.4 | v6.32,29.97 6.07,30.02 | v12.14,30.35 11.84,30.71 | 21.77,26.01 21.69,26.16
  Bottom 0.343: 22.55,21.87 22.35,21.62
  Bottom 0.356: 0.89,35.18 1.65,34.42 | 4.2,12.12 4.15,12.12
  Bottom 0.406: 4.09,12 4.2,12.12 | v23.8,26.04 24.66,26.57 23.95,26.42 | S$3.P$4 15.88,1.35 | 1.65,34.42 v2.56,35.46 | 2.49,6.73 2.26,6.91 | v4.36,28.78 4.09,27.43 | v4.27,12.89 3.73,13.06 | 22.35,21.62 23.39,21.59 24.03,21.18 | 8.66,32.97 8.74,33.02 | v5.84,8.47 5.79,8.53 | 18.47,37.11 18.9,37.44 | v8.46,32.94 8.28,33.3 | IC$4.29 v2.44,6.81 | v18.9,36.47 19.36,36.47 | v5.97,15.67 5.84,15.67 | v7.7,21.44 7.77,21.59 | 23.88,23.22 24.11,23.09 | 20.9,26.06 20.88,25.68 | 10.08,29.26 10.19,29.54 | v9.68,30.86 9.6,31.65 | v18.75,18.34 18.24,18.26 | v20.17,16.97 20.37,17.12 | 7.57,0.84 3.89,0.84 3.76,2.06
  Bottom 0.508: v20.78,29.31 18.29,28.5 | 20.45,28.04 20.75,27.79
  Bottom 0.61: 24.03,21.18 23.75,21.21 23.9,21.01 | 17.22,30.48 17.67,30.19 | 17.67,30.19 17.8,30.1 | v17.55,30.43 17.67,30.19 | v23.37,24.23 23.85,23.9 | v3.61,2.69 4.95,2.59
  other vias: 4.32,16.21 21.16,4.83 22.2,4.83 21.16,3.89 25.48,8.86 21.46,26.09 11.13,9.58 11.99,10.01 11.99,9.17 11.2,12.7
  pour Bottom: -0.03,38.89 26.62,39.04 26.42,1.4 -0.23,1.4
  pour Top: 4.6,12.45 3.58,12.47 3.78,13.54 5.16,16.15 6.83,16.18 6.65,15.65 6.07,15.11 5.99,14.27 5.94,13.94 5.28,13.94 4.78,13.44 4.6,12.83 4.6,12.47
I2CSCL  (via drill 0.3, 0.33, 0.36)
  Top 0.165: 17.2,21.59 18.24,21.59
  Top 0.178: 5.01,26.58 arc-90 5.19,26.4 | 18.24,21.59 18.29,21.84 18.29,22.25 18.54,22.56 IC$1.6 | U$3.P$11 22.25,7.62 22.45,7.85 25.12,7.85 v25.79,7.71
  Top 0.203: IC$3.P$2 3.96,25.12 2.16,25.12 v2.16,26.85 3.61,26.85 3.78,26.82 4.12,26.58 5.01,26.58 | IC$5.29 16.18,19.58 16.97,20.7 16.97,21.13 17.2,21.59
  Top 0.229: 5.19,26.4 R3.2
  Top 0.254: v8.19,12.36 8.87,12.7 8.87,13 9.27,13.39 v10.44,13.66
  Top 0.406: IC$5.29 14.48,19.48 12.6,18.09 v11.56,18.09 | v9.7,19.1 v7.9,19.1 | v2.97,18.82 v3.1,20.32
  Bottom 0.178: v25.79,7.71 25.4,2.45 24.28,1.75 24.28,0.67 10.82,0.67 10.82,4.14 11.2,5 11.58,5.36 IC$4.18
  Bottom 0.406: 4.84,23.94 5.05,23.57 5.33,23.29 6.02,21.84 6.6,19.71 7.47,19.33 v7.9,19.1 | 4.84,23.94 v2.16,26.85 | IC$4.18 11.62,8.36 10.24,8.89 10.24,12.8 v10.44,13.66 | 4.84,23.94 3.12,23.27 3.12,22.61 v3.1,20.32 | v8.19,12.36 8.27,12.36 7.85,12.37 7.24,12.95 4.57,15.21 3.89,15.29 3.53,15.87 3.53,17.98 v2.97,18.82 | v11.56,18.09 v9.7,19.1
I2CSDA  (via drill 0.3, 0.33, 0.36)
  Top 0.178: R5.2 5.28,28.99 7.39,28.99
  Top 0.203: IC$3.P$10 7.06,25.51 7.06,26.98 7.39,27.2 7.39,28.99 | IC$5.30 16.38,20.65 v16.64,22 | v18.95,23.88 IC$1.5
  Top 0.254: 2.36,28.17 5.04,28.17 R5.2 | U$3.P$13 21.18,7.6 21.39,7.87 21.84,7.87 22.1,8.03 22.1,9.2 v22.25,9.14
  Top 0.305: v2.31,28.12 2.34,28.17 2.36,28.17
  Top 0.406: v7.04,10.39 v7.63,8.51 | IC$5.30 14.3,20.27 12.75,19.61 v11.68,19.61 | v8.61,20.42 v8.61,21.74 | v2.16,18.14 v2.16,20.35
  Bottom 0.178: 26.34,9.53 26.34,0.34 10.19,0.34 IC$4.20
  Bottom 0.203: v16.64,22 17.32,22.61 18.11,22.61 v18.95,23.88 | v22.25,9.14 22.45,9.7 26.24,9.7 26.24,9.63 26.34,9.53
  Bottom 0.279: 3,15.47 3,17.35 v2.16,18.14 | v2.16,20.35 2.36,21.21 2.36,25.12
  Bottom 0.406: IC$4.19 IC$4.20 10.21,7.64 10.03,8.25 8.79,8.25 8.31,8.43 v7.63,8.51 | 3,15.47 4.04,14.07 5.03,14.07 6.25,12.85 v7.04,10.39 | 2.36,25.12 1.68,25.53 1.47,25.68 1.47,27.66 1.6,28.09 v2.31,28.12 5.38,24.33 6.5,23.75 v8.61,21.74 | v11.68,19.61 11.05,19.84 9.63,20.42 v8.61,20.42
INTEGCLR  (via drill 0.33)
  Top 0.254: v1.5,22.76 0.89,22.94 0.89,28.55 1.17,29.16 1.8,29.57 2.41,30.68 2.69,30.71 4.9,30.71 5.18,30.84 v5.33,31.24 | v5.44,29.55 5.54,29.36 6.99,29.36 v7.16,29.87 | IC$6.P$4 10.16,30.19 v9.41,30.07
  Top 0.305: IC$7.P$4 7.49,30.61 v7.16,29.87
  Top 0.406: v1.47,21.34 2.92,21.08 4.37,21.08 4.9,20.28 4.9,18.95 5.46,17.88 IC$5.14
  Bottom 0.254: v1.5,22.76 v1.47,21.34 | 9.47,30.12 v9.41,30.07 7.42,30.12 v7.16,29.87 | v5.33,31.24 v5.44,29.55
IOUT1
  Top 0.178: IC$12.P$5 12.45,34.82
  Top 0.203: 12.45,34.82 12.68,35.15
  Top 0.254: 12.68,36.63 12.65,35.95
  Top 0.381: 12.68,35.15 12.68,36.63 12.68,38.15
  Top 0.394: 11.2,38.15 11.81,38.15
  Top 0.406: 11.2,38.15 3.53,38.15 3.25,36.93 IC$8.P$6 | 11.81,38.15 12.68,38.15
IOUT2
  Top 0.178: 10.77,35.41 IC$12.P$7
  Top 0.305: IC$9.P$6 5.79,36.96 5.87,37.21 6.07,37.6 8.89,37.6 9.07,37.26 9.07,35.98 9.75,35.98 9.93,35.84 10.03,35.41 10.77,35.41
IOUT3
  Top 0.178: 11.18,33.38 IC$12.P$2
  Top 0.254: 11.66,33.1 11.18,33.38 | 12.71,33.1 J3.1
  Top 0.406: 12.71,33.1 11.66,33.1
IOUT4
  Top 0.178: 9.94,33.55 9.88,33.71 9.91,34.01 IC$12.P$10
  Top 0.356: 9.94,33.55 9.94,32.2 10.72,32.2
  Top 0.406: 10.72,32.2 11.66,32.18 12.07,32.14 J5.1
MEASURE1
  Top 0.178: IC$12.P$3 12.58,34.02
  Top 0.254: 12.58,34.02 13.49,33.83
  Top 0.356: C24.1 13.28,29.69 IC$6.P$2 11.02,29.69
  Top 0.381: 13.49,33.83 13.49,31.52 13.48,30.91 | 9.88,27.81 9.88,25.12
  Top 0.406: 9.88,27.81 9.88,28.07 10.44,29.36 10.77,29.57 11.02,29.69 | C24.1 13.48,30.91 11.95,31.19 11.61,31.22 C27.1 | 9.88,25.12 9.01,24.87 IC$5.7
MEASURE2
  Top 0.178: 9.17,34.39 9.59,34.41 IC$12.P$9
  Top 0.305: 7.26,31.52 6.96,31.14 IC$7.P$2
  Top 0.356: 7.26,31.52 7.29,31.14 8.64,31.14
  Top 0.406: 7.26,31.52 7.26,32.08 6.63,32.33 6.22,32.35 5.44,32 4.5,32 C25.1 | IC$5.8 8.33,25.04 8.33,28.55 C26.1 8.33,29.82 8.64,30.33 8.64,31.14 8.76,31.23 9.37,31.62 9.37,32.54 9.17,33.17 9.17,34.39
N$1
  Top 0.406: J3.2 14.25,33.24 14.12,34.11 14.07,34.44 14.07,35.99 IC$11.P$6
N$2
  Top 0.305: 19.75,32.18 19.74,32.46 19.89,32.64 20.37,32.72
  Top 0.318: 19.75,30.95 19.75,32.18
  Top 0.406: 20.37,32.72 20.37,35.92 19.53,37.19 17.25,37.19 17.22,36.93 IC$13.P$6 | J5.2 14.53,31.95 14.83,31.8 16.46,31.38 18.8,30.94 19.75,30.95
N$3
  Top 0.335: IC$6.P$1 14,29.19
  Top 0.406: 14,29.19 C24.2 14.86,29.16 15.37,29.54 R8.1
N$4  (via drill 0.3)
  Top 0.178: v12.72,11.87 U$6.P$5
  Bottom 0.178: R2.2 v12.72,11.87
N$6
  Top 0.381: IC$7.P$1 5.99,31.62 5.99,30.68 4.9,30.18 C25.2
  Top 0.61: R9.1 C25.2
N$7
  Top 0.203: 5.33,24.31 IC$3.P$4
  Top 0.254: C15.2 5.71,23.75 5.71,23.98 5.33,24.31
N$9
  Top 0.406: R6.1 Y1.P$1
  Top 0.508: C17.2 15.6,27.41 Y1.P$1
N$10
  Top 0.61: IC$2.5 I1.P$1
N$12
  Bottom 0.406: IC$4.27 5.28,7.11 5.05,8.87 3.45,8.89 2.74,9.63 C20.2
N$13  (via drill 0.3)
  Top 0.254: D6.C D5.C v1.14,12.34
  Bottom 0.254: S$1.P$1 2.54,2.31 0.38,2.31 0.38,12.32 v1.14,12.34
  Bottom 0.406: S$1.P$1 S$1.P$2
N$15
  Bottom 0.305: C11.2 24.33,8.2 23.16,8.2 22.81,7.92 IC$4.2
N$16
  Bottom 0.305: C11.1 23.01,8.71 22.07,7.9 IC$4.3
N$17
  Top 0.203: U$3.P$20 19.15,5.33
  Top 0.254: U$2.P$5 16.46,6.43 16.35,6.72 | 16.35,6.72 C7.2 | 19.15,5.33 18.69,5.33 16.35,6.72
N$18
  Top 0.178: R1.2 18.67,2.77 U$3.P$25
N$19
  Bottom 0.178: IC$4.26 5.99,5.07 2.67,5.07 R10.2
N$20
  Top 0.178: U$3.P$23 18.75,3.73 18.67,3.43 17.14,3.43 R1.1
N$21
  Top 0.165: U$3.P$3 24.18,4.83 24.18,5.33 24.28,5.56 C5.1
N$22
  Top 0.254: U$3.P$1 24.16,3.33 C3.1
N$23
  Top 0.178: C10,5-3.2 25.5,7.09 25.01,7.48 23.75,7.48 U$3.P$9
N$24
  Bottom 0.305: C12.1 20.47,8.69 20.7,8.1 IC$4.5
N$25
  Top 0.178: C4.1 24.23,3.83 U$3.P$2
N$26
  Top 0.178: X1.P$1 21.82,2.26 21.29,2.26 U$3.P$28
  Top 0.254: C1.1 23.42,0.64 23.29,1.24 X1.P$1
N$27
  Bottom 0.305: C12.2 IC$4.4
N$28
  Top 0.254: C2.1 19.3,1.98 19.91,1.98 | 19.91,1.98 20.34,2.26 20.62,2.44 20.7,2.54 U$3.P$27 | X1.P$3 20.96,0.58 19.91,1.98
N$30
  Bottom 0.406: IC$4.28 4.62,6.63 4.42,8.28 2.64,8.28 C21.2
N$32
  Top 0.203: R12.1 8.76,10.06 U$6.P$13
N$33
  Top 0.178: U$6.P$12 8.94,10.41 7.64,10.41 7.57,10.79 7.57,11.56 8.1,11.68 8.79,11.84 8.92,12.27 9.37,12.62 R13.1
NRST
  Top 0.254: 11.38,25.16 11.58,26.92 C19.1
  Top 0.279: 11.41,25.07 11.38,25.16
  Top 0.406: IC$5.4 11.41,25.07
OSC_IN
  Top 0.381: 13.89,24.82 C13.2 15.37,24.84
  Top 0.406: 13.89,24.82 13.34,24.82 13.06,24.44 13.01,24.11 IC$5.2 | 15.37,24.84 16.31,24.94 18.11,25.6 Y1.P$2
OSC_OUT
  Top 0.305: IC$5.3 12.22,24.26 12.22,25.35 R6.2
PBI$1  (via drill 0.3)
  Top 0.203: v3.18,11.3 2.26,11.35 2.26,13.79 | 2.26,13.79 2.26,14.91 3.63,16.61 4.01,16.87 5.38,17.12 IC$5.15 | D5.A 2.26,13.79 | v12.83,4.95 6.17,4.95 5.13,2.57 4.45,2.57 4.19,3.33 4.19,6.65 4.52,6.98 6.78,8.13 6.78,8.91 v5.99,9.37 D3.C
  Bottom 0.203: v3.18,11.3 4.19,9.4 6.02,9.4 v5.99,9.37 | S$3.P$1 v12.83,4.95
  Bottom 0.406: S$3.P$1 13.21,4.29 S$3.P$2
PBI$2  (via drill 0.3)  (1 unrouted)
  Top 0.203: 8.08,13.31 7.7,12.93 6.22,11.1 | 3.81,1.96 1.35,1.96 0.38,2.72
  Top 0.216: 6.22,11.1 6.22,10.08 5.22,10.08 5.03,9.4
  Top 0.229: 16.56,1.8 14.12,1.8
  Top 0.254: IC$5.19 9.8,14.12 9.75,14.07 8.76,13.61 8.08,13.31 D4.C | 16.56,1.8 16.74,1.7 v16.74,1.8 | 5.03,9.4 4.57,8.56 D6.A 0.38,7.37 0.38,2.72 | 14.12,1.8 13.77,0.46 13.23,0.38 4.52,0.38 3.81,1.96
  Bottom 0.254: v16.74,1.8 17.4,2.54 17.86,3 19.58,3 S$2.P$1
SCRPWR  (via drill 0.33)
  Top 0.254: IC$5.27 14.22,17.88 v14.15,17.09
  Bottom 0.356: R7.1 17.09,15.72 15.6,16.31 v14.15,17.09
  Bottom 0.381: Q1.P$3 18.31,13.08 18.34,14.25
  Bottom 0.406: 18.34,14.25 18.31,14.83 18.14,15.34 R7.1
SCRRES  (via drill 0.3, 0.33)
  Top 0.406: v13.25,12.94 v12.07,13.13 | IC$5.18 9.02,15.6 9.32,16.15 v10.49,16.15
  Bottom 0.254: IC$4.14 14.22,9.07 13.36,9.55 13.36,12.42 13.28,12.62 v13.25,12.94
  Bottom 0.406: v12.07,13.13 11.91,15.01 11.79,15.7 v10.49,16.15
SCRVREG  (via drill 0.3, 0.33)
  Top 0.381: 16.51,8.13 17.08,8.71 v18.41,9.93
  Top 0.406: C14.2 15.93,3.05 v15.98,3.17 | v18.83,8.84 v18.41,9.93 | v16.56,8.13 16.51,8.13
  Bottom 0.254: 20.02,8.2 19.99,6.98
  Bottom 0.305: 20.02,6.55 IC$4.6 19.99,6.98
  Bottom 0.381: 17.5,3.91 16.92,3.91 16.66,4.28 16.51,4.5
  Bottom 0.406: 16.51,4.5 16.51,5.51 IC$4.11 | 16.54,6.68 IC$4.11 | v15.98,3.17 16.66,4.28 | 17.5,3.91 17.88,4.24 IC$4.9 | Q1.P$1 v18.41,9.93 | IC$4.11 16.54,6.96 v16.56,8.13 | 20.02,8.2 19.21,8.2 v18.83,8.84
SPIMISO  (via drill 0.3)
  Top 0.178: v17.74,8.27 18.92,8.28 19.2,7.87
  Top 0.203: U$3.P$14 20.68,7.67 20.52,7.87 19.2,7.87 | v13.28,13.7 11.94,13.74 11.41,14.12
  Top 0.406: IC$5.21 11.41,14.12
  Bottom 0.159: 13.79,13.41 13.79,11.96
  Bottom 0.165: 13.79,13.41 v13.28,13.7
  Bottom 0.203: v17.74,8.27 17.35,9.47 14.38,9.47 13.79,10.03 13.79,11.96
SWDCLK/USBD+  (via drill 0.3, 0.32, 0.33)  (1 unrouted)
  Top 0.152: v17.2,11.86 16.56,11.73 16.5,11.53 16.5,10.26 U$4.P$1
  Top 0.178: U$4.P$6 15.09,10.19 v14.86,10.06 | v14.15,14.02 13.82,14.45 IC$5.24
  Top 0.406: U1.D+ 19.03,14.07 v17.55,14.63
  Bottom 0.152: v14.86,10.06 14.15,11.15 v14.15,14.02
  Bottom 0.203: v17.55,14.63 17.04,13.06 v17.2,11.86
SWDIO/USBD-  (via drill 0.33)  (1 unrouted)
  Top 0.203: U$4.P$4 v15.19,11.76 | v13.01,15.9 IC$5.23
  Top 0.305: 13.01,14.59 IC$5.23
  Bottom 0.203: v15.19,11.76 15.19,14.63 15.21,15.72 14.5,16 v13.01,15.9
  Bottom 0.305: v13.01,15.9 13.03,15.9
USBD-
  Top 0.406: U1.D- 19.23,13.41 16.59,13.41 R4.1
VBAT
  Top 0.254: 9.27,8.71 9.29,9 | 9.29,9 U$6.P$14 | U$6.P$15 9.29,9 | U$6.P$16 9.8,8.15
  Top 0.61: U$5.P$2 4.8,6.35 5.05,6.6 7.14,7.67 8.41,7.67 8.67,7.84 | 8.67,7.84 9.27,8.23 | 9.27,8.23 9.27,8.71 | 9.27,8.23 9.8,8.15 | C35.1 8.67,7.84
VCC
  Top 0.178: IC$2.1 23.24,24.92 24.38,24.92 IC$2.3
  Top 0.254: U$6.P$20 12.62,8.25 12.93,8.71 U$6.P$1 13.21,9.07
  Top 0.381: 15.19,13.33 16.23,14.38
  Top 0.406: 20.88,24.03 20.88,23.95 21.39,24.16 | 13.21,9.07 14.11,9.07 14.11,11.4 14.78,12.67 15.19,13.33
  Top 0.61: IC$2.1 21.77,24.92 C8.2 20.88,23.95
  pour Top: 14.73,13.87 19.05,13.84 19.05,18.92 26.67,18.92 26.7,23.93 20.35,23.93 14.73,18.95
  pour Top: 24.43,26.09 26.34,26.09 26.37,22.81 24.51,22.83 24.51,25.43
  pour Top: 12.8,9.27 13.64,9.45 13.74,12.19 14.99,13.61 15.6,13.23 15.6,11.96 15.39,10.44 14.27,8.92
VREG  (via drill 0.33)  (3 unrouted)
  Top 0.152: 13.36,9.7 13.68,9.8 13.68,11.73 R4.2
  Top 0.178: v7.6,15.16 8.21,15.11 | U$6.P$2 13.18,9.55 13.36,9.7 | IC$12.P$1 10.77,33.22
  Top 0.203: C9.2 3.98,25.52 IC$3.P$1 5.36,25.51 | 12.9,17.07 10.72,17.09 | 10.77,33.22 v10.64,32.87
  Top 0.229: 7.68,22.86 7.68,24.71 IC$3.P$8 | 6.59,27.47 6.38,26.87 6.42,26.46 R3.1 | 6.2,27.46 R5.1
  Top 0.249: 3.34,27.51 4.23,27.46 6.2,27.46
  Top 0.254: 6.42,26.46 5.71,25.6 | 5.71,25.6 5.71,24.74 5.69,24.71 IC$3.P$8 | 5.71,25.6 5.36,25.51 | C16.1 3.34,27.51 | 6.2,27.46 6.59,27.47 | 8.21,15.54 8.33,15.75 8.36,15.98 8.36,16.74 8.66,16.99 8.84,17.04 | 7.68,22.86 8.03,22.58 9.2,22.58 9.65,22.1 | 20.47,24.87 18.49,24.82
  Top 0.305: IC$5.17 8.21,15.11 8.21,15.54 | 13.82,23.69 IC$5.1 | 5.84,33.71 5.92,33 | IC$7.P$5 7.8,32.29 7.75,32.46 7.46,32.91 | 12.27,28.65 11.89,29.19 IC$6.P$5
  Top 0.356: 24.76,27.76 IC$2.4
  Top 0.381: 13.82,23.69 14.05,23.48 15.67,23.48 15.93,23.85 C18.2 | 7.46,35.1 7.46,35.91 7.6,36.4 | 7.46,35.1 7.46,32.91 | C32.1 7.46,35.1 | 18.52,33.59 17.22,33.84 | 13.92,16.15 12.9,17.07
  Top 0.406: 8.84,17.04 9.22,17.09 10.72,17.09 10.72,18.54 11.05,20.22 11.05,20.35 | 11.05,20.35 11.05,22.1 9.65,22.1 | 16.5,24.12 C18.2 | C29.1 C30.1 6.37,12.34 6.71,12.6 7.01,12.9 7.01,13.74 7.57,14.33 IC$5.17 | IC$5.1 13.79,22.68 12.88,20.4 12.7,20.32 11.05,20.35 | IC$1.8 v21.34,21.26 | C6.1 22.33,27.13 23.75,27.13 24.05,27.81 | R4.2 14.58,15.19 13.92,16.15 | 4.93,33.73 3.4,33.73 3.23,33.72 IC$8.P$1 | 4.93,33.73 5.84,33.71 | IC$5.5 10.62,24.14 10.62,25.5 10.53,25.59 C22.1 | 10.62,26.26 10.53,26.4 C22.1 | 7.46,32.91 5.92,33 5.79,34.16 IC$9.P$1 | C28.1 4.93,33.73 | IC$11.P$1 14.69,34.23 14.91,33.45 15.01,33.43 15.11,32.38 16.87,31.9 17.58,31.75 C37.1 | C34.1 18.7,33.76 | 18.7,33.76 18.52,33.59 | 17.22,33.84 17.22,34.16 IC$13.P$1 | C37.1 J4.2 | C37.1 18.7,33.76 | 20.54,30.38 20.06,30.06 19.2,30.01 18.31,29.85 17.91,29.74 17.4,29.57 16.36,29.39 15.11,28.08 12.27,28.08 12.27,28.65 | C22.1 C23.1 10.62,27.69 11.2,28.08 | v8.66,32.13 7.8,32.29 | J1.1 10.57,36.2 11.33,36.17 11.74,36.47 J2.2
  Top 0.409: 12.27,28.08 11.2,28.08
  Top 0.508: 18.49,24.82 C18.2
  Top 0.533: 24.05,27.81 IC$2.4
  Top 0.559: 8.31,36.68 J1.2
  Top 0.61: 24.33,28.69 IC$2.4 | v25.2,29.06 I1.P$2 | 21.18,32.26 J4.1 20.54,30.38 | 8.31,36.68 7.6,36.4
  Bottom 0.178: R11.2 v7.6,15.16
  Bottom 0.406: R7.2 18.9,13.61 Q1.P$2 | v21.34,21.26 22.61,20.83 22.61,18.62 | v10.64,32.87 8.94,32.08 v8.66,32.13
  Bottom 0.61: R7.2 19.24,16.15 19.24,16.4 19.24,16.66 19.25,17.6 21.01,18.68 21.34,18.62 22.61,18.62 24.66,18.62 25.6,19.23 25.6,21.34 25.63,27.92 v25.2,29.06
  pour Top: 25.53,32.05 21.59,29.08 14.22,24.56 14.22,22.43 17.14,22.48 20.14,24.28 21.82,25.58 24.79,27.28 25.86,29.54
  pour Top: 7.62,22.73 13.97,22.73 13.97,15.11 7.62,15.11
  pour Top: 20.17,38.07 20.09,30.81 8.84,29.29 8.79,25.5 14.4,25.63 17.6,28.7 24.41,29.9 26.31,30.63 26.31,38.07
  pour Top: 2.54,37.97 20.32,37.97 20.32,31.62 2.54,31.62
VUSB
  Top 0.203: 11.28,7.54 C10.2 | 10.9,7.98 U$6.P$18
  Top 0.254: U$4.P$5 16,10.64 | U$6.P$17 U$6.P$18 U$6.P$19
  Top 0.406: 18.52,12.77 U1.VBUS
  Top 0.508: 13.96,8.27 14.73,8.27 14.73,9.3 15.85,9.3 16,9.53
  Top 0.533: 16,12.01 16,10.64 16,9.53
  Top 0.559: 17.71,12.75 18.52,12.77
  Top 0.584: 16,12.01 16.74,12.75 17.71,12.75
  Top 0.61: 13.96,8.27 12.83,7.54 11.28,7.54 10.9,7.98
WKUP  (via drill 0.33)
  Top 0.178: D4.A 6.33,13.75 v6.55,14.63 7.01,14.66 7.04,14.81 7.04,15.57 7.14,15.8 7.85,15.82 7.98,16.21 7.98,17.02 8.74,17.6 9.91,17.63 10.11,17.81 10.26,18.09 v10.26,21.41 | v11.74,21.08 11.74,22.38 11.18,22.63 10.01,22.63 9.8,22.71 IC$5.6
  Top 0.254: D3.A 4.06,9.42 4.65,9.93 4.67,9.96 4.89,10.29 4.89,12.52 5.16,12.98 D4.A
  Bottom 0.178: v10.26,21.41 v11.74,21.08 | R11.1 7.62,13.36 6.99,14.02 v6.55,14.63

### Text on the board
bNames: ZP | ZN